# EAGLE design PROYECT2019 (EAGLE 8.6.3)
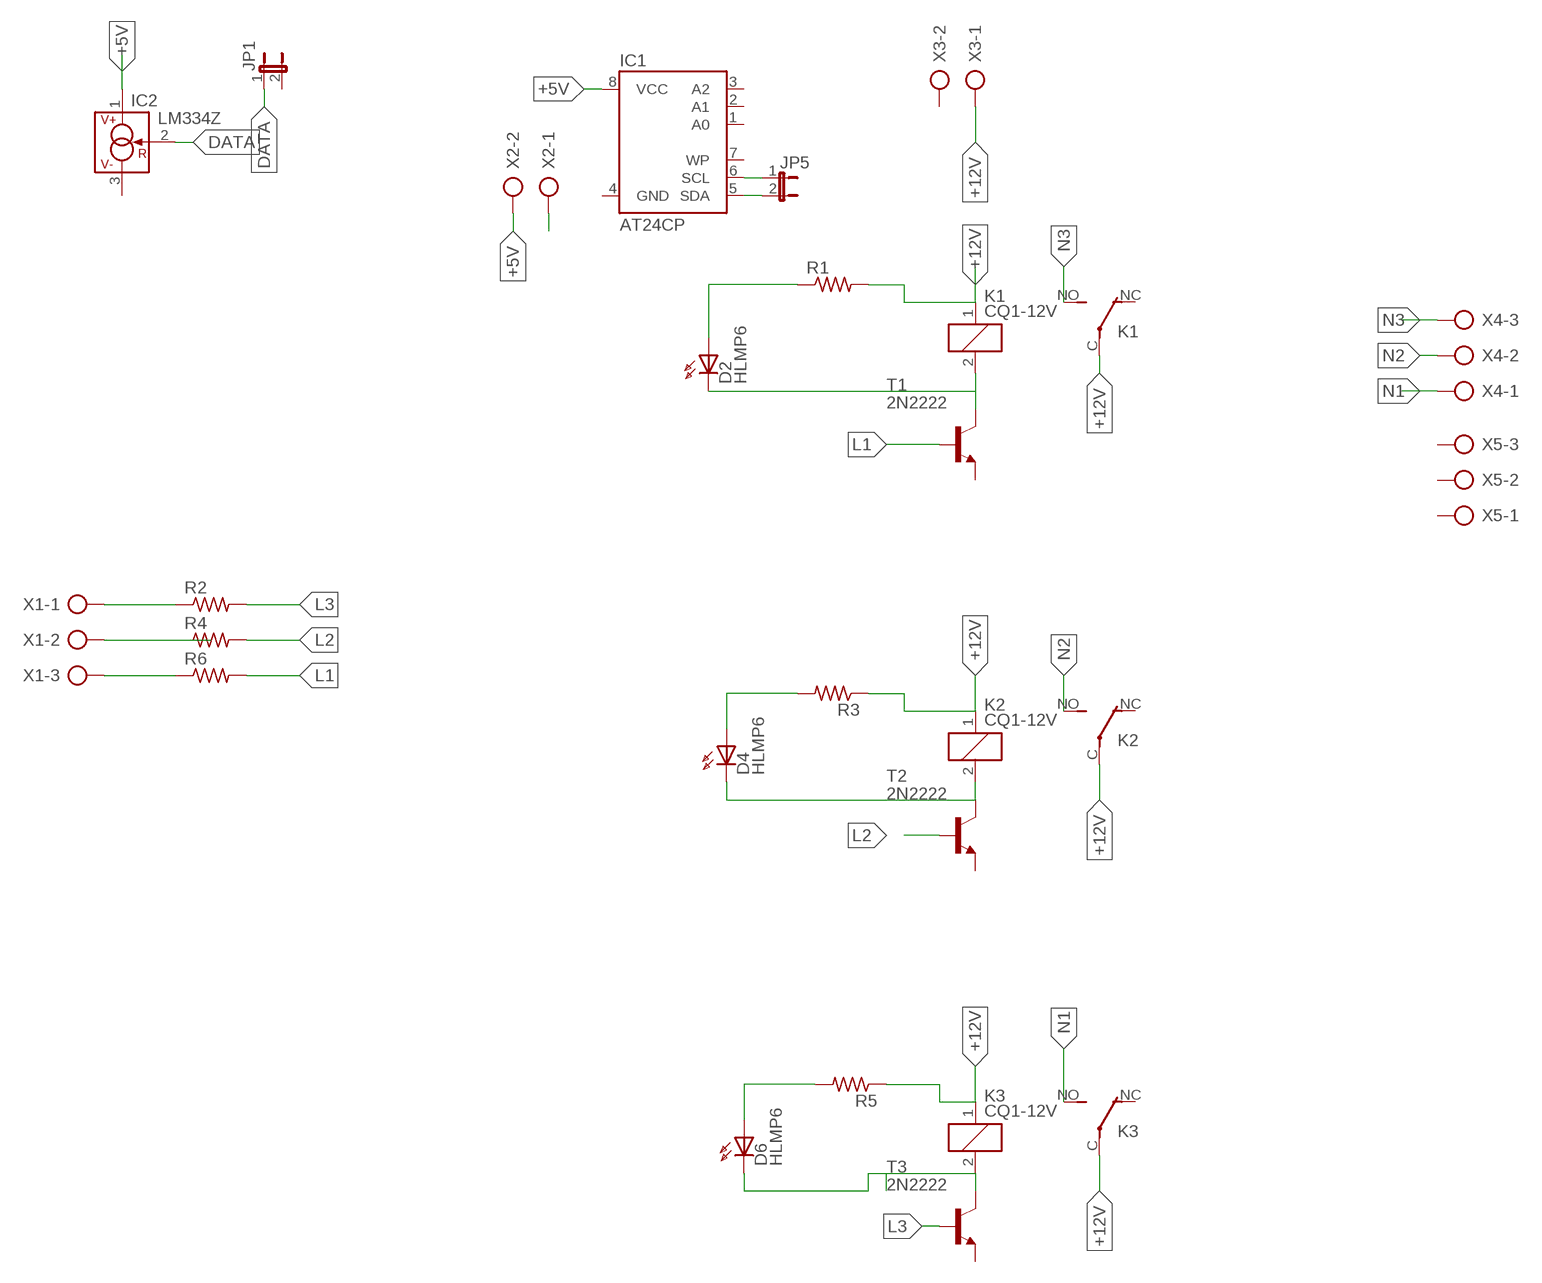
[diagram p0: schematic, sheet 1]

## Parts
D2  HLMP6  [HLMP6]
D4  HLMP6  [HLMP6]
D6  HLMP6  [HLMP6]
IC1  AT24CP  [DIL08]
IC2  LM334Z  [TO92]
JP1  JP1E  [JP1]
JP5  JP1E  [JP1]
K1  CQ1-12V  [CQ1]
K2  CQ1-12V  [CQ1]
K3  CQ1-12V  [CQ1]
R1  R-US_0207/12  [0207/12]
R2  R-US_0207/12  [0207/12]
R3  R-US_0207/12  [0207/12]
R4  R-US_0207/12  [0207/12]
R5  R-US_0207/12  [0207/12]
R6  R-US_0207/12  [0207/12]
T1  2N2222  [TO18]
T2  2N2222  [TO18]
T3  2N2222  [TO18]
X1  AK300/3  [AK300/3]
X2  AK300/2  [AK300/2]
X3  AK300/2  [AK300/2]
X4  AK300/3  [AK300/3]
X5  AK300/3  [AK300/3]

## Nets
+5V: IC1.8(VCC) IC2.1(V+) X2.2
+12V: K1.1 K1.C(2:P) K2.1 K2.C(2:P) K3.1 K3.C(2:P) R1.2 R3.1 R5.1 X3.1
DATA: IC2.2(R) JP1.1
L1: R6.2 T1.2(B)
L2: R4.2 T2.2(B)
L3: R2.2 T3.2(B)
N1: K3.NO(2:S) X4.1
N2: K2.NO(2:S) X4.2
N3: K1.NO(2:S) X4.3
N$1: R2.1 X1.1
N$2: R4.1 X1.2
N$3: R6.1 X1.3
N$4: D2.A R1.1
N$5: D2.K K1.2 T1.3(C)
N$6: D4.A R3.2
N$7: D6.A R5.2
N$8: D4.K K2.2 T2.3(C)
N$9: D6.K K3.2 T3.3(C)
N$33: IC1.6(SCL) JP5.1
N$34: X2.1
N$35: IC1.5(SDA) JP5.2
Unconnected: IC1.1(A0) IC1.2(A1) IC1.3(A2) IC1.7(WP) IC2.3(V-) JP1.2 K1.NC(2:O) K2.NC(2:O) K3.NC(2:O) T1.1(E) T2.1(E) T3.1(E) X3.2 X5.1 X5.2 X5.3

## Power pins joined to a net without a drawn wire
GND: IC1.4(GND)

## Library data of the parts
D2 D4 D6 = display-hp:HLMP6: LED 2mm horizontal; MF: AGILENT TECHNOLOGIES; MPN: HLMP-6500; OC_FARNELL: 1652490; OC_NEWARK: 40K0088
IC1 = atmel:AT24C*: 2-wire serial EEPROM; MPN: AT24C1024BW-SH-B; OC_FARNELL: 1362646; OC_NEWARK: 03P2044
IC2 = linear:LM*34: 3-Terminal Adjustable Current Sources Source: www.national.com/pf/LM/LM334.html | LM134.pdf
JP1 JP5 = jumper:JP1E: JUMPER
K1-K3 = relay:CQ1-12V: AUTOMOTIVE QUIET RELAY NAiS Source: http://www.mew-europe.com/.. en_ds_61208_0000.pdf; OC_FARNELL: unknown; OC_NEWARK: unknown
R1-R6 = rcl:R-US_: RESISTOR, American symbol; SPICEPREFIX: R
T1-T3 = transistor:2N2222: NPN TRANSISTOR
X1 X4 X5 = con-ptr500:AK300/3: CONNECTOR; OC_FARNELL: unknown; OC_NEWARK: unknown
X2 X3 = con-ptr500:AK300/2: CONNECTOR; OC_FARNELL: unknown; OC_NEWARK: unknown

## Board
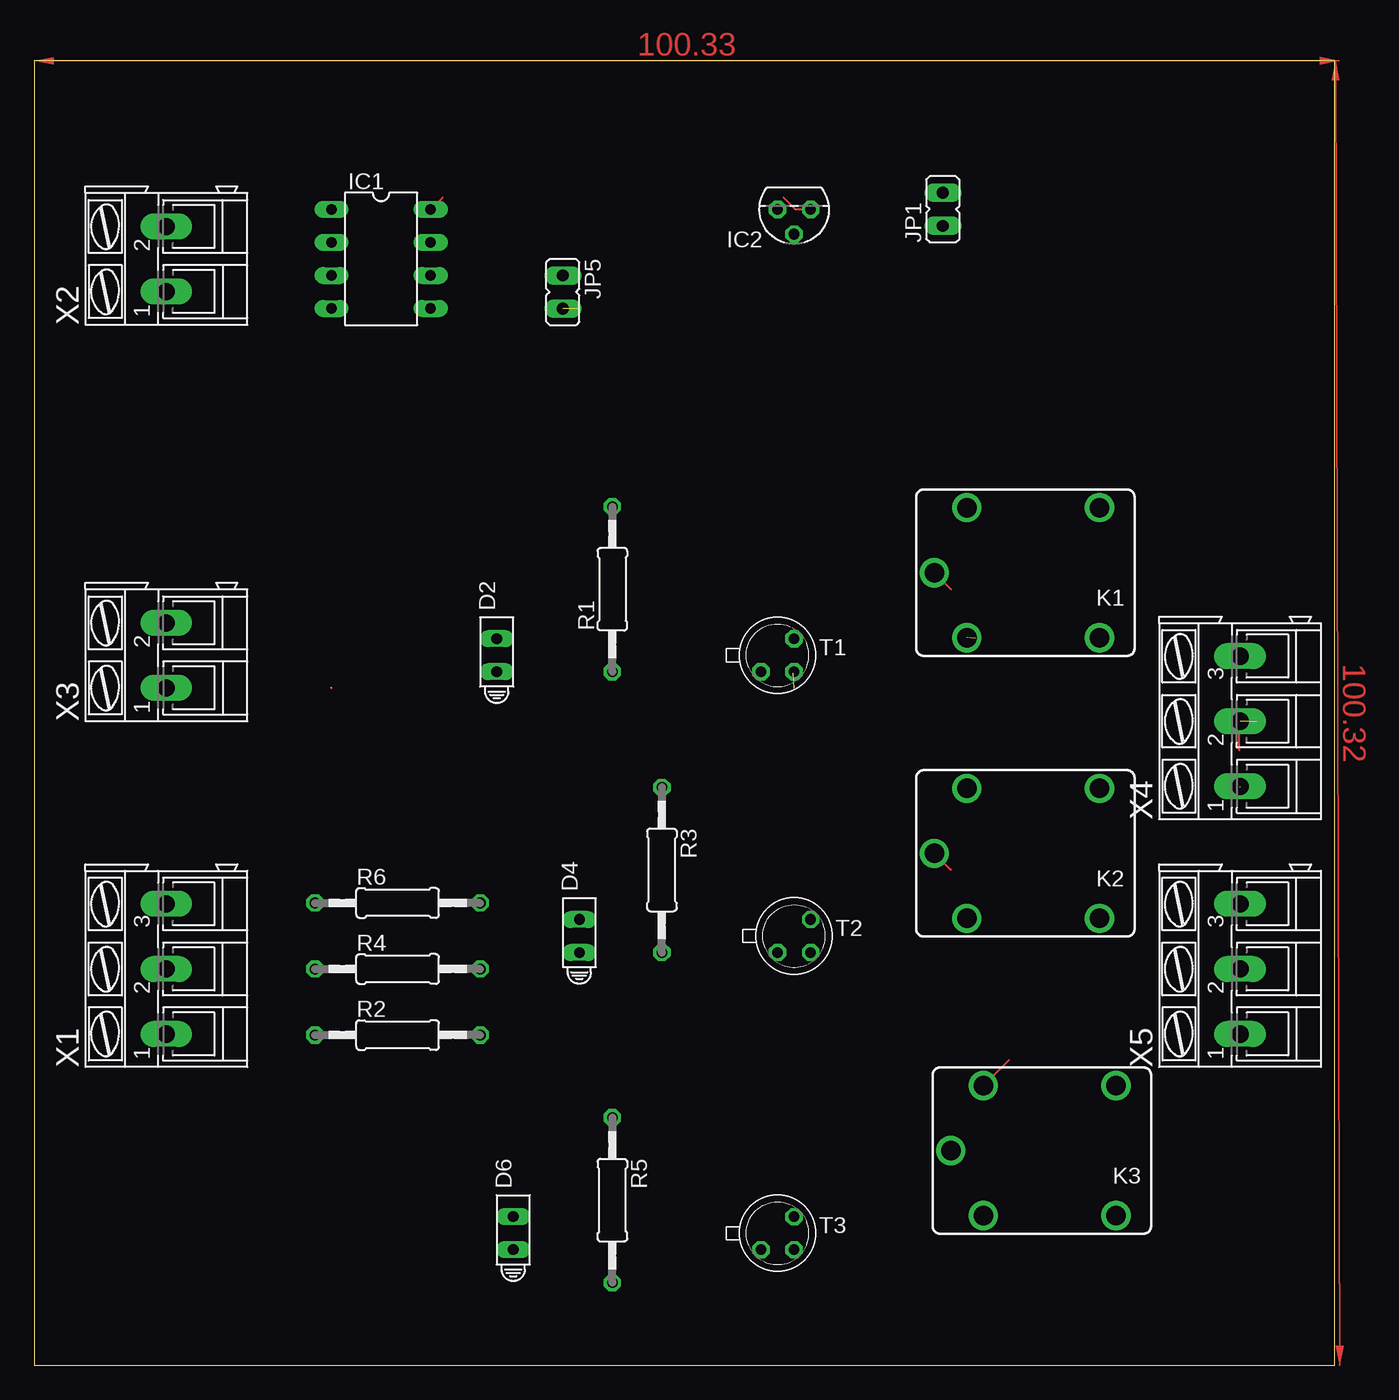
[diagram p1: board, top side]
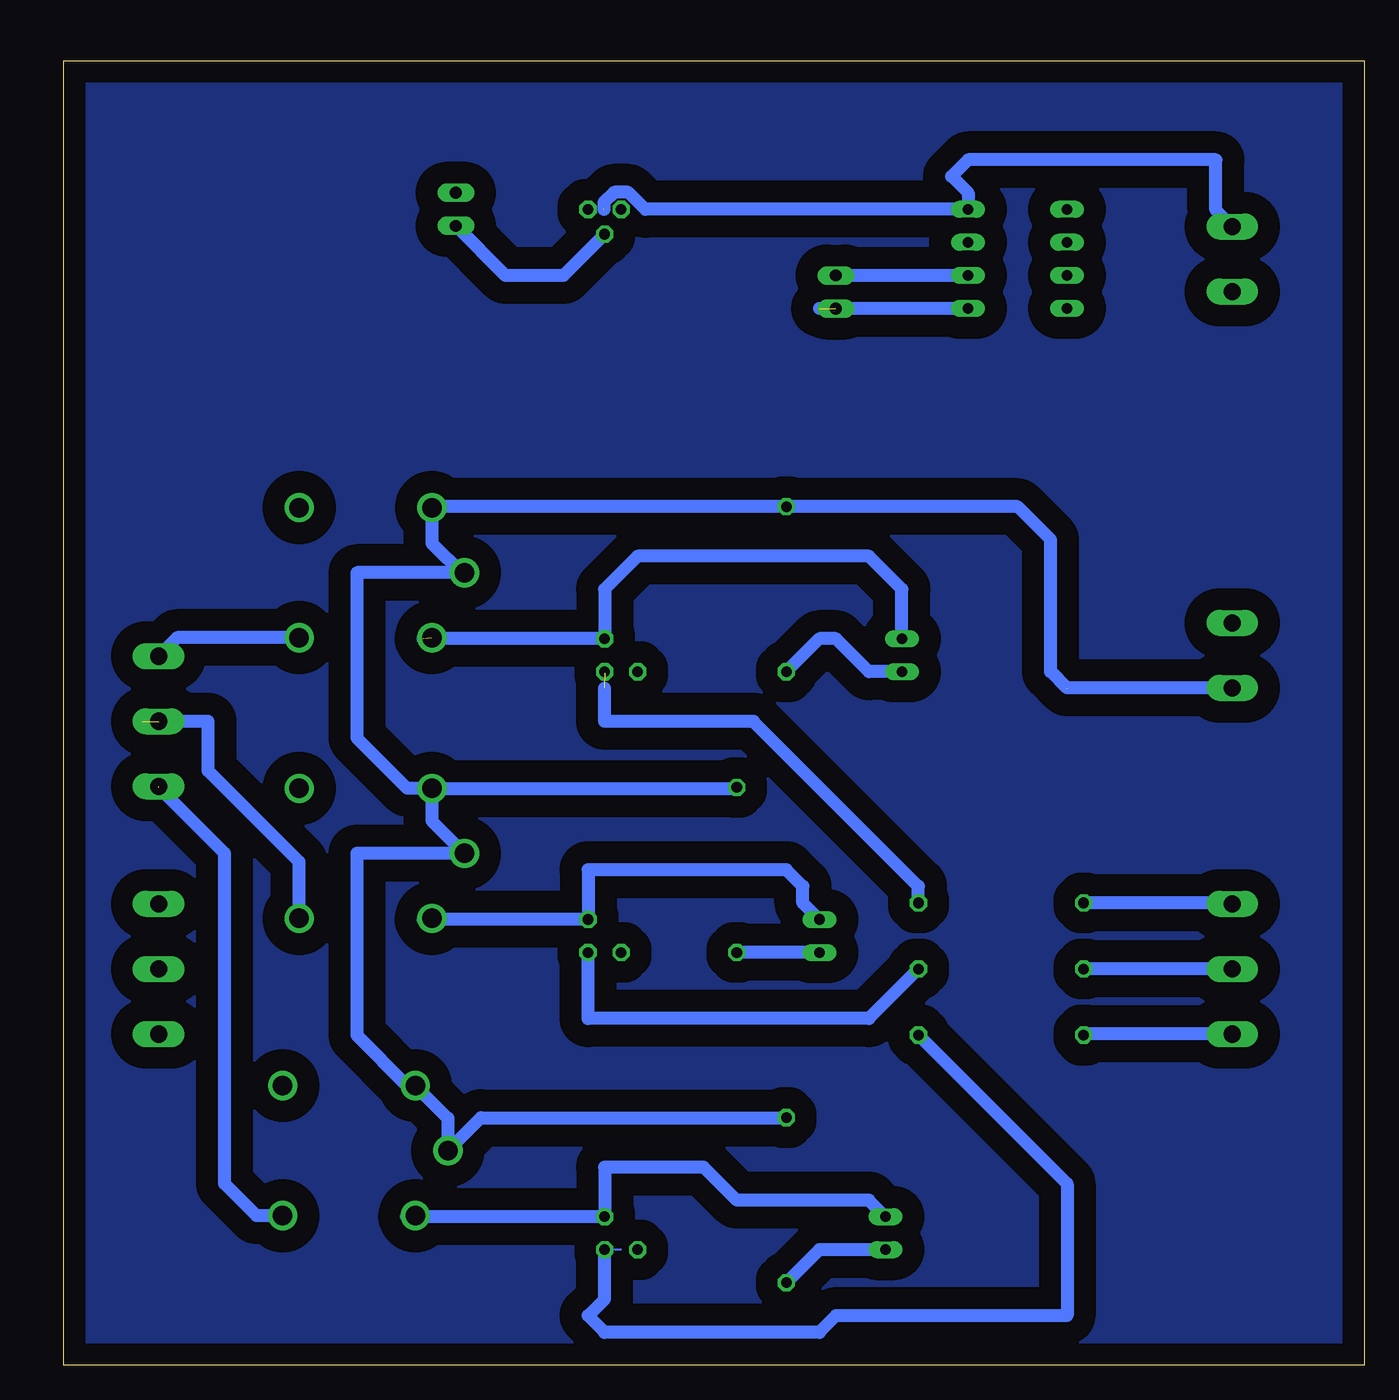
[diagram p2: board, bottom side, seen from below]

Size 100 x 100.32 mm. Coordinates in mm from the lower left corner, seen from the top.
Outline: 0,0 100,0 100,100.32 0,100.32 0,0
Copper layers (1*16): Top 0.035mm / dielectric 1.5mm / Bottom 0.035mm
Design rules "default": minimum track width 6mil, minimum drill 0.35mm, track to track 6mil, track to pad 6mil, pad to pad 6mil, via to via 6mil, smd to smd 6mil, copper to edge 40mil, drill to drill 6mil, minimum pad ring 10mil, minimum via ring 8mil, stop-mask expansion 4mil, vias tented up to drill 0mil, thermal gap 10mil

### Footprints (pad centres in the part's own frame; a part is rotated, then mirrored left to right if it is on the bottom)
HLMP6 = drill 0.813 long: A -1.27,0; K 1.27,0
DIL08 = drill 0.813 long: 1 -3.81,-3.81; 2 -1.27,-3.81; 3 1.27,-3.81; 4 3.81,-3.81; 5 3.81,3.81; 6 1.27,3.81; 7 -1.27,3.81; 8 -3.81,3.81
TO92 = drill 0.813 octagon: 1 -1.27,0; 2 0,1.905; 3 1.27,0
JP1 = drill 0.914 long: 1 0,-1.27; 2 0,1.27
CQ1 = drill 1.5: 1 4.5,-5; 2 4.5,5; C 7,0; NC -5.7,-5; NO -5.7,5
0207/12 = drill 0.813 octagon: 1 -6.35,0; 2 6.35,0
TO18 = drill 0.813 octagon: 1 -1.27,-1.27; 2 1.27,-1.27; 3 1.27,1.27
AK300/3 = drill 1.321 long: 1 -5.004,0; 2 0,0; 3 5.004,0
AK300/2 = drill 1.321 long: 1 -2.515,0; 2 2.489,0

### Placement (x,y rotation side)
D2  35.56,54.61 90 top
D4  41.91,33.02 90 top
D6  36.83,10.16 90 top
IC1  26.67,85.09 270 top
IC2  58.42,88.9 180 top
JP1  69.85,88.9 0 top
JP5  40.64,82.55 180 top
K1  76.2,60.96 180 top
K2  76.2,39.37 180 top
K3  77.47,16.51 180 top
R1  44.45,59.69 90 top
R2  27.94,25.4 0 top
R3  48.26,38.1 270 top
R4  27.94,30.48 0 top
R5  44.45,12.7 270 top
R6  27.94,35.56 0 top
T1  57.15,54.61 0 top
T2  58.42,33.02 0 top
T3  57.15,10.16 0 top
X1  10.16,30.48 90 top
X2  10.16,85.09 90 top
X3  10.16,54.61 90 top
X4  92.71,49.53 90 top
X5  92.71,30.48 90 top

### Tracks (layer width: path | path; a pad name or v marks a point on that pad's centre or on a via)
+5V  (1 unrouted)
  Top 0.152: 10.21,87.68 X2.2 | IC2.1 58.52,88.9 57.61,89.81 | IC1.8 31.39,89.81
  Bottom 1.016: X2.2 11.43,88.85 11.43,92.71 30.48,92.71 31.75,91.44 30.48,90.17 IC1.8 55.28,88.9 56.6,90.22 57.7,90.22 58.47,89.45 58.47,88.9
+12V  (1 unrouted)
  Top 0.152: 69.34,61.01 K1.C 70.47,59.69 | 71.63,65.89 K1.1 71.62,66.04 | 48.31,44.4 R3.1 | 71.63,44.4 K2.1 | K2.C 70.47,38.1 | 22.84,52.09 22.86,52.07 | 74.93,23.47 K3.1
  Bottom 0.152: 10.21,52.17 X3.1 | 69.34,60.86 K1.C | 71.63,44.4 K2.1
  Bottom 1.016: X3.1 22.89,52.09 24.13,53.34 24.13,63.5 26.67,66.04 R1.2 71.62,66.04 K1.1 71.7,63.22 69.34,60.86 | K2.1 71.7,41.87 K2.C 77.47,39.37 77.47,25.4 73.58,21.51 K3.1 70.47,19.01 K3.C 67.93,19.05 R5.1 | K2.1 48.34,44.37 R3.1 | K1.C 77.47,60.96 77.47,48.26 73.58,44.37 K2.1
DATA
  Top 0.152: 69.34,87.07 69.8,87.53 JP1.1
  Bottom 1.016: IC2.2 61.59,83.82 66.04,83.82 JP1.1
L1  (1 unrouted)
  Bottom 0.152: 58.37,53.24 T1.2
  Bottom 1.016: R6.2 34.29,36.83 46.99,49.53 58.42,49.53 58.42,52.07
L2
  Bottom 1.016: R4.2 38.1,26.67 59.69,26.67 T2.2
L3
  Bottom 0.152: 57.15,8.89 T3.2 | 34.29,25.35 R2.2
  Bottom 1.016: R2.2 22.86,13.97 22.86,3.81 40.64,3.81 41.91,2.54 58.42,2.54 59.69,3.81 58.42,5.08 T3.2
N1  (1 unrouted)
  Bottom 1.016: K3.NO 85.17,11.51 87.63,13.97 87.63,39.37 92.71,44.45
N2  (1 unrouted)
  Top 0.152: 92.66,47.3 92.66,49.43 X4.2 | 81.99,34.49 K2.NO
  Bottom 1.016: K2.NO 81.9,38.72 88.9,45.72 88.9,49.53 93.98,49.53
N3
  Bottom 1.016: K1.NO 91.28,55.96 X4.3
N$1
  Top 0.152: 21.49,25.5 R2.1 | 10.21,25.5 X1.1
  Bottom 1.016: X1.1 21.51,25.48 R2.1
N$2
  Top 0.152: 21.49,30.53 R4.1 | 10.21,30.53 X1.2
  Bottom 1.016: X1.2 R4.1
N$3
  Top 0.152: 10.21,35.56 X1.3
  Bottom 1.016: X1.3 10.24,35.56 R6.1
N$4
  Bottom 1.016: D2.A 38.1,53.34 40.64,55.88 41.91,55.88 R1.1
N$5  (1 unrouted)
  Top 0.152: 35.66,55.98 D2.K | 58.37,55.98 T1.3 58.52,55.98 | 71.63,55.98 K1.2
  Bottom 1.016: D2.K 35.56,59.69 38.1,62.23 55.88,62.23 58.42,59.69 T1.3 72.39,55.88
N$6
  Bottom 1.016: D4.A R3.2
N$7
  Bottom 1.016: D6.A 41.91,8.89 R5.2
N$8
  Bottom 1.016: D4.K 43.18,35.56 43.18,36.83 44.45,38.1 59.69,38.1 T2.3 72.39,34.29 72.31,34.37 K2.2
N$9
  Top 0.152: 36.88,11.48 D6.K | 58.37,11.48 T3.3 58.52,11.48 | 72.85,11.48 K3.2
  Bottom 1.016: D6.K 38.1,12.7 48.26,12.7 50.8,15.24 58.42,15.24 T3.3 73.66,11.43 73.58,11.51 K3.2
N$10
  pour Bottom (isolate 1.676): 0,0 0,100.33 100.33,100.33 100.33,0
N$33
  Top 0.152: 30.48,83.87 IC1.6 | 40.54,83.87 JP5.1
  Bottom 1.016: IC1.6 JP5.1
N$35  (1 unrouted)
  Bottom 1.016: IC1.5 41.91,81.28
(copper drawn outside any net)
  shapes: Top area x2